# EasyEDA schematic Hub75 LED Matrix Adapter for ESP32 DevKitC V4_2021-01-14.json
TITLE: Hub75 Adapter for ESP32 DevKitC V4; REV: 2; Date: 2020-12-17; Sheet: 1/1; Drawn By: Kenn; Company: KZ
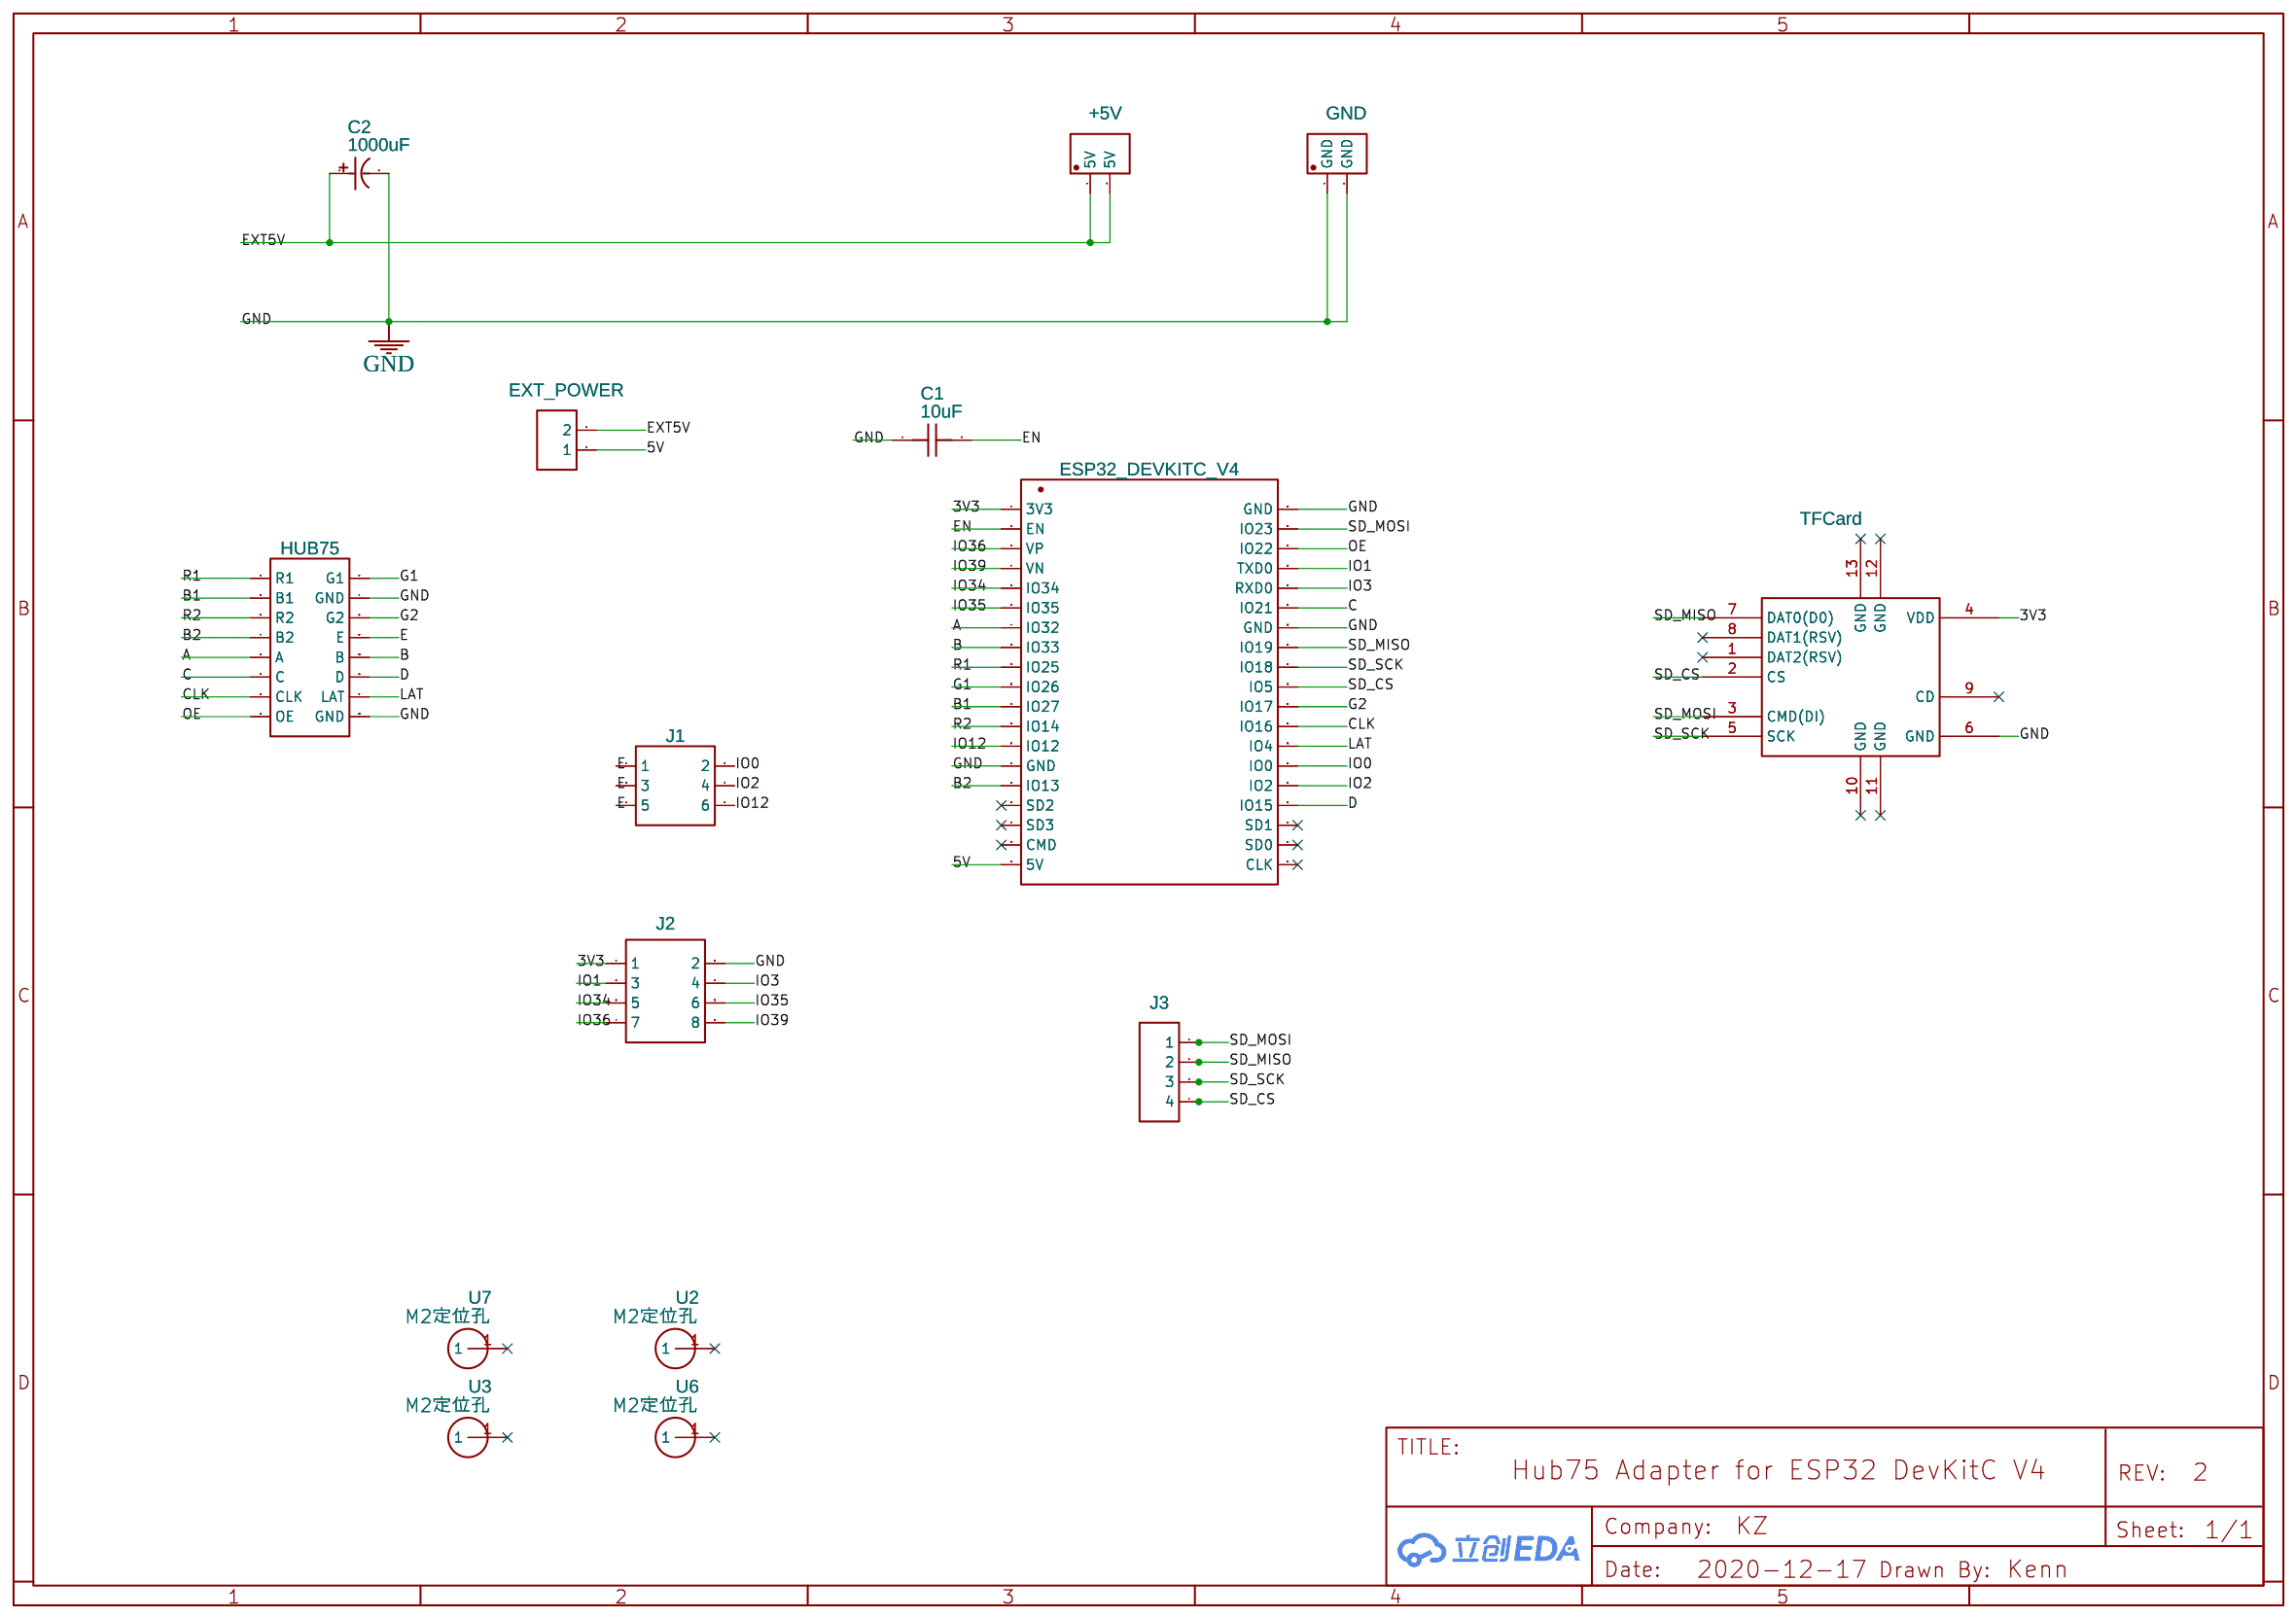
[diagram p0: schematic sheet]

## Parts
+5V  WJ2EDGVC-5.08-2P  [WJ2EDGVC-5.08-2P]
C1  10uF  [C1206]
C2  1000uF  [CAP-TH_BD10.0-P5.00-D1.0-FD]
CARD1  TFCard  [TF-SMD_TF-015]
ESP32_DEVKITC_V4  ESP32-DevKitC V4 开发板  [ESP32-DEVKIT-C]
EXT_POWER  HDR-F-2.54_1x2  [HDR-M-2.54_1X2]
GND  WJ2EDGVC-5.08-2P  [WJ2EDGVC-5.08-2P]
HUB75  HUB75-IDC-2.54-2X8P  [HDR-IDC-2.54-2X8P]
J1  HDR-M-2.54_2x3  [HDR-M-2.54_2X3]
J2  HDR-M-2.54_2x4  [HDR-M-2.54_2X4]
J3  HDR-M-2.54_1x4  [HDR-M-2.54_1X4]
U2  M2定位孔  [M2定位孔]
U3  M2定位孔  [M2定位孔]
U6  M2定位孔  [M2定位孔]
U7  M2定位孔  [M2定位孔]

## Library data of the parts
+5V GND = -: Supplier: LCSC; Manufacturer: ReliaPro; image: //image.lceda.cn/szlcsc/C8445.jpg; Supplier Part: C8445
C1 = CGA5L3X5R1V106KT0Y0N: Supplier: LCSC; Supplier Part: C445690; Manufacturer: TDK; Contributor: LCSC
C2 = 1000uF 16V: Supplier: LCSC; Manufacturer: ValuePro; Supplier Part: C43909
CARD1 = TF-015: Supplier: LCSC; Manufacturer: SOFNG; Supplier Part: C113206
ESP32_DEVKITC_V4 = ESP32-DevKitC V4 开发板: Supplier: LCSC; Supplier Part: C571180; Manufacturer: Espressif Systems; Manufacturer Part: ESP32-DevKitC V4; Contributor: Kenn; link: https://item.szlcsc.com/597078.html
EXT_POWER = HDR-F-2.54_1x2: Supplier Part: C49661; Supplier: LCSC; Contributor: LCEDA_Lib
HUB75 = -: Supplier: LCSC; Manufacturer: BOOMELE; Manufacturer Part: IDC Box 2.54mm 16P　Straight; image: //image.lceda.cn/szlcsc/C3406.jpg; Supplier Part: C3406
J1 = HDR-M-2.54_2x3: Supplier Part: C65114; Supplier: LCSC; Contributor: LCEDA_Lib
J2 = HDR-M-2.54_2x4: Supplier Part: C58363; Supplier: LCSC; Contributor: LCEDA_Lib
J3 = HDR-M-2.54_1x4: Supplier Part: C124378; Supplier: LCSC; Contributor: LCEDA_Lib
U2 U3 U6 U7 = M2定位孔: Contributor: haxiny

## Nets
3V3: CARD1.4(VDD) ESP32_DEVKITC_V4.1(3V3) J2.1
5V: ESP32_DEVKITC_V4.19(5V) EXT_POWER.1
GND: C1.1 C2.2 CARD1.6(GND) ESP32_DEVKITC_V4.14(GND) ESP32_DEVKITC_V4.32(GND) ESP32_DEVKITC_V4.38(GND) GND.1(GND) GND.2(GND) HUB75.4(GND) HUB75.16(GND) J2.2
A: ESP32_DEVKITC_V4.7(IO32) HUB75.9(A)
B: ESP32_DEVKITC_V4.8(IO33) HUB75.10(B)
B1: ESP32_DEVKITC_V4.11(IO27) HUB75.3(B1)
B2: ESP32_DEVKITC_V4.15(IO13) HUB75.7(B2)
C: ESP32_DEVKITC_V4.33(IO21) HUB75.11(C)
CLK: ESP32_DEVKITC_V4.27(IO16) HUB75.13(CLK)
D: ESP32_DEVKITC_V4.23(IO15) HUB75.12(D)
E: HUB75.8(E) J1.1 J1.3 J1.5
EN: C1.2 ESP32_DEVKITC_V4.2(EN)
EXT5V: +5V.1(5V) +5V.2(5V) C2.1 EXT_POWER.2
G1: ESP32_DEVKITC_V4.10(IO26) HUB75.2(G1)
G2: ESP32_DEVKITC_V4.28(IO17) HUB75.6(G2)
IO0: ESP32_DEVKITC_V4.25(IO0) J1.2
IO1: ESP32_DEVKITC_V4.35(TXD0) J2.3
IO2: ESP32_DEVKITC_V4.24(IO2) J1.4
IO3: ESP32_DEVKITC_V4.34(RXD0) J2.4
IO12: ESP32_DEVKITC_V4.13(IO12) J1.6
IO34: ESP32_DEVKITC_V4.5(IO34) J2.5
IO35: ESP32_DEVKITC_V4.6(IO35) J2.6
IO36: ESP32_DEVKITC_V4.3(VP) J2.7
IO39: ESP32_DEVKITC_V4.4(VN) J2.8
LAT: ESP32_DEVKITC_V4.26(IO4) HUB75.14(LAT)
OE: ESP32_DEVKITC_V4.36(IO22) HUB75.15(OE)
R1: ESP32_DEVKITC_V4.9(IO25) HUB75.1(R1)
R2: ESP32_DEVKITC_V4.12(IO14) HUB75.5(R2)
SD_CS: CARD1.2(CS) ESP32_DEVKITC_V4.29(IO5) J3.4
SD_MISO: CARD1.7(DAT0(D0)) ESP32_DEVKITC_V4.31(IO19) J3.2
SD_MOSI: CARD1.3(CMD(DI)) ESP32_DEVKITC_V4.37(IO23) J3.1
SD_SCK: CARD1.5(SCK) ESP32_DEVKITC_V4.30(IO18) J3.3

Not connected (* = marked no-connect by the designer): CARD1 1(DAT2(RSV))* 8(DAT1(RSV))* 9(CD)* 10(GND)* 11(GND)* 12(GND)* 13(GND)*; ESP32_DEVKITC_V4 16(SD2)* 17(SD3)* 18(CMD)* 20(CLK)* 21(SD0)* 22(SD1)*; U2 1*; U3 1*; U6 1*; U7 1*
